# EAGLE design Adafruit-MAX17048-STEMMA (EAGLE 9.6.2)
COMPANY: ADAFRUIT INDUSTRIES; DRAWN: KTOWN; REV: A
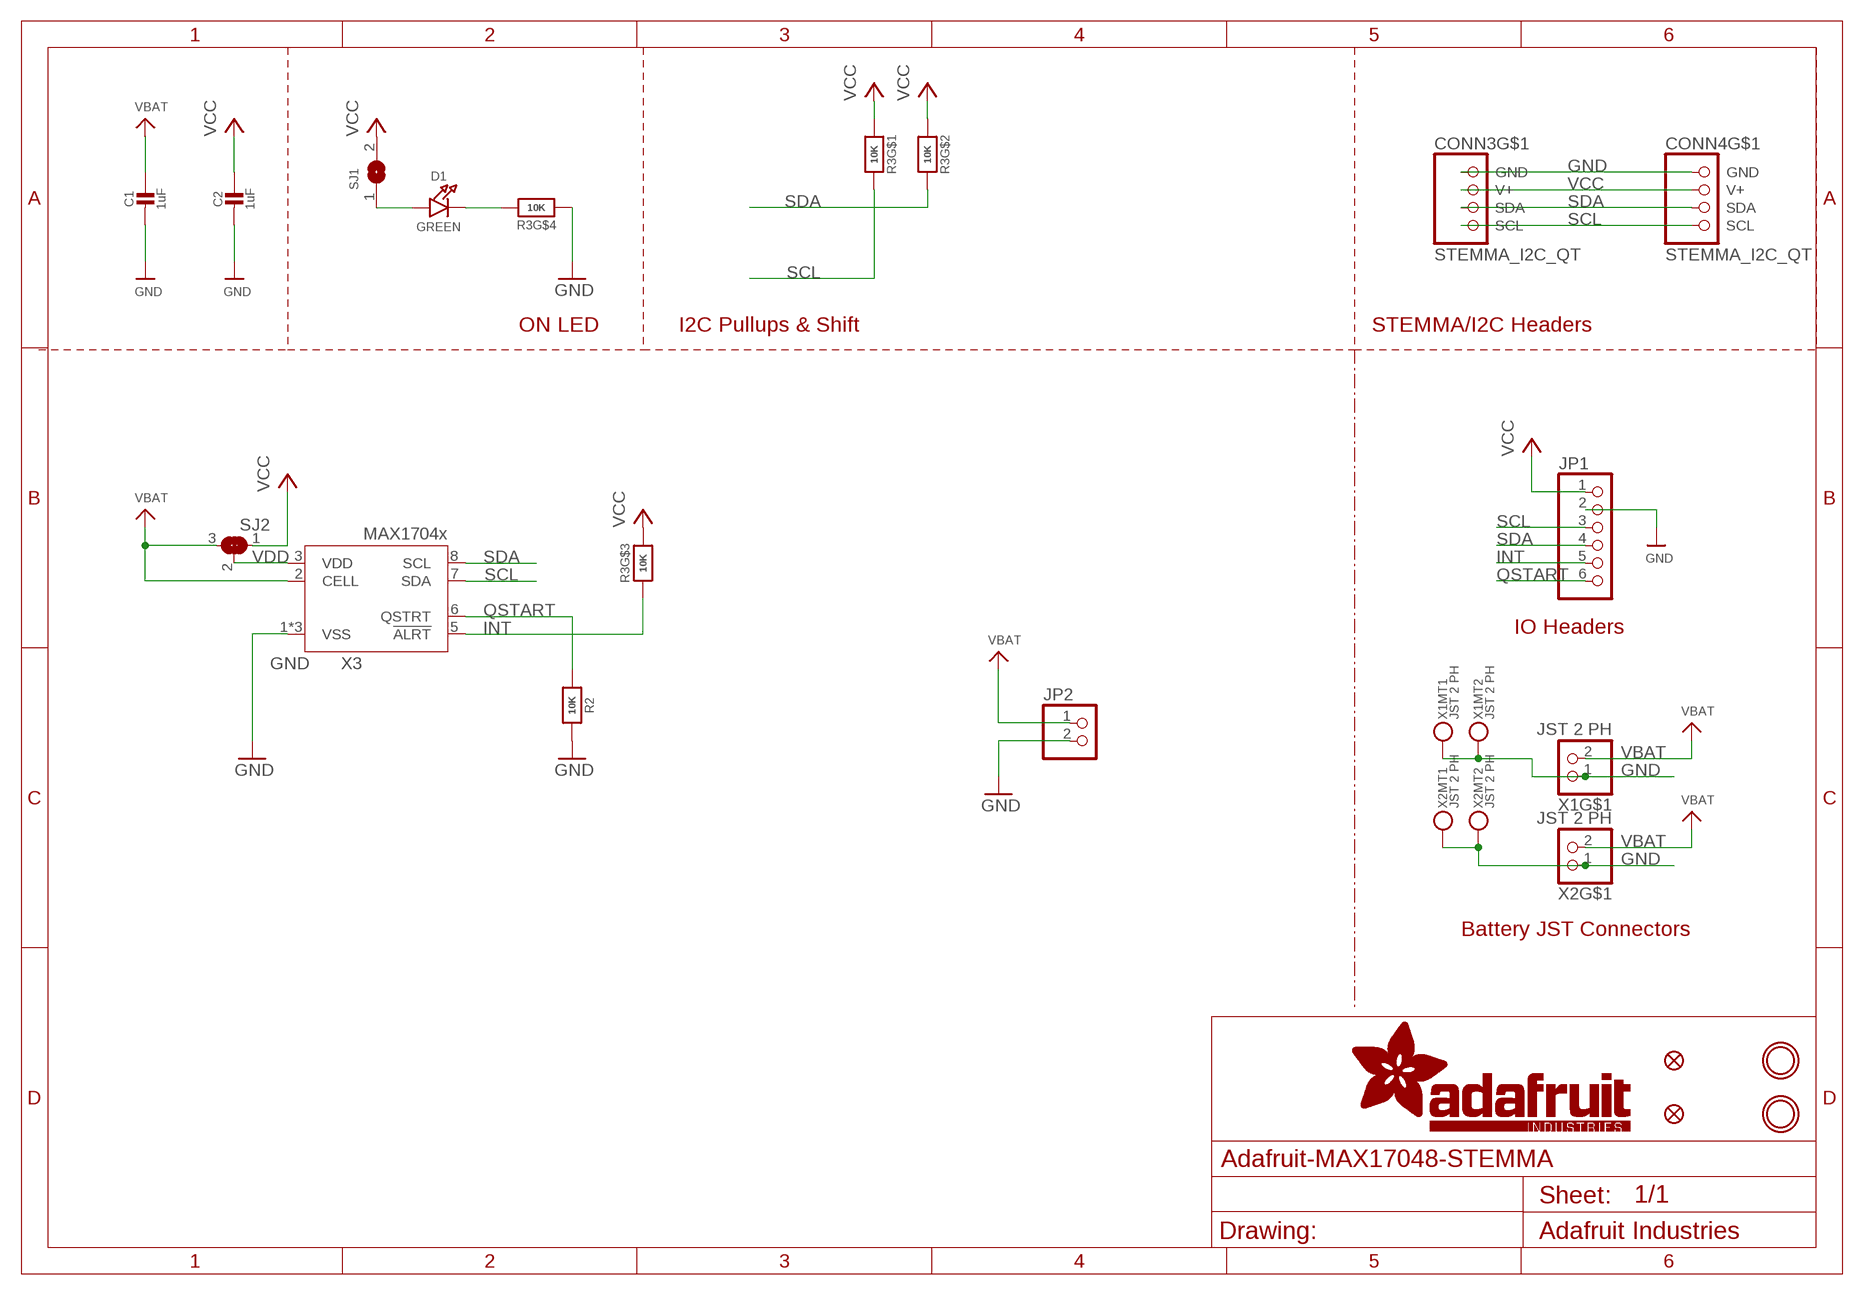
[diagram p0: schematic, sheet 1]

## Parts
C1  1uF  CAP_CERAMIC0603_NO  [0603-NO]
C2  1uF  CAP_CERAMIC0603_NO  [0603-NO]
CONN3  STEMMA_I2C_QT  [JST_SH4]
CONN4  STEMMA_I2C_QT  [JST_SH4]
D1  GREEN  LED0603_NOOUTLINE  [CHIPLED_0603_NOOUTLINE]
FID3  FIDUCIAL_1MM  [FIDUCIAL_1MM]
FID4  FIDUCIAL_1MM  [FIDUCIAL_1MM]
JP1  HEADER-1X670MIL  [1X06_ROUND_70]
JP2  HEADER-1X2ROUND  [1X02_ROUND]
R2  10K  RESISTOR_0603_NOOUT  [0603-NO]
R3  10K  RESISTOR_4PACK  [RESPACK_4X0603]
SJ1  SOLDERJUMPERCLOSED  [SOLDERJUMPER_CLOSEDWIRE]
SJ2  SOLDERJUMPER_2WAY  [SOLDERJUMPER_2WAY_OPEN_NOPASTE]
U$19  MOUNTINGHOLE2.5  [MOUNTINGHOLE_2.5_PLATED]
U$21  MOUNTINGHOLE2.5  [MOUNTINGHOLE_2.5_PLATED]
X1  JST 2 PH  CON_JST_PH_2PIN_MT_BATT  [JSTPH2_BATT]
X2  JST 2 PH  CON_JST_PH_2PIN_MT_BATT  [JSTPH2_BATT]
X3  MAX17048/T  [TDFN8_2X2MM]

## Nets
GND [highpower]: C1.2 C2.2 CONN3.1(GND) CONN4.1(GND) JP1.2 JP2.2 R2.2 R3.4 X1.1 X1.NC1 X1.NC2 X2.1 X2.NC1 X2.NC2 X3.1(VSS) X3.4(VSS) X3.THERMAL(VSS)
INT: JP1.5 R3.3 X3.5(!ALRT)
N$1: D1.C R3.5
N$2: D1.A SJ1.1
QSTART: JP1.6 R2.1 X3.6(QSTRT)
SCL: CONN3.4(SCL) CONN4.4(SCL) JP1.3 R3.8 X3.7(SDA)
SDA: CONN3.3(SDA) CONN4.3(SDA) JP1.4 R3.7 X3.8(SCL)
VBAT [highpower]: C1.1 JP2.1 SJ2.3 X1.2 X2.2 X3.2(CELL)
VCC [lowpower]: C2.1 CONN3.2(V+) CONN4.2(V+) JP1.1 R3.1 R3.2 R3.6 SJ1.2 SJ2.1
VDD: SJ2.2 X3.3(VDD)
Unconnected: CONN3.MT1(MT) CONN3.MT2(MT) CONN4.MT1(MT) CONN4.MT2(MT)

## Notes on the sheet
- ON LED | I2C Pullups & Shift | STEMMA/I2C Headers
- IO Headers
- Battery JST Connectors

## Library data of the parts
C1 C2 = microbuilder:CAP_CERAMIC: Ceramic Capacitors For new designs, use the packages preceded by an '_' character since they are more reliable: The following footprints should be used on most boards: _0402 - Standard footprint for regular board layouts _0603 - Standard footprint for regular board layouts _0805 - Standard footprint for regular board layouts _1206 - Standard footprint for regular board layouts For extremely tight-pitch boards where space is at a premium, the following 'micro-pitch' footprints can be used (smaller pads, no silkscreen outline, etc.): _0402MP - Micro-pitch footprint for very dense/compact boards _0603MP - Micro-pitch footprint for very dense/compact boards _0805MP - Micro-pitch footprint for very dense/compact boards _1206MP - Micro-pitch footprint for very dense/compact boards
CONN3 CONN4 = microbuilder:STEMMA_I2C
D1 = microbuilder:LED: LED 0603 - 0603 Surface Mount Package 2mA: Green LED - Low Power (3.9mcd, 2ma, 1.7Vf) - Digikey: 475-2709-2-ND Orange LED - Low Power (9.8mcd, 2ma, 1.8Vf) - Digikey: 475-1194-2-ND Red LED - Low Power (5mcd, 2ma, 1.8Vf) - Digikey: 475-1195-2-ND Yellow LED - Low Power (7mcd, 2ma, 1.8Vf) - Digikey: 475-1196-2-ND 5mA: Blue LED - Low Power (17mcd, 5ma, 2.9Vf) - Digikey: LNJ937W8CRACT-ND 0805 - 0805 Surface Mount Package 2mA: Red LED (8.8mcd, 2mA, 1.8Vf, Clear) - Low Power [Digikey: 475-2510-1-ND] Green LED (5mcd, 2mA, 1.8Vf, Clear) - Low Power [Digikey: 475-2730-1-ND] Yellow LED (11.3mcd, 2mA, 1.8Vf, Clear) - Low Power [Digikey: 475-2555-1-ND] 20mA: Red LED (104mcd, 20mA, Diffused) - LS R976 [Digikey: 475-1278-6-ND] Red LED (12mcd, 20mA, 2.0Vf, Clear) - APT2012EC [Digikey: 754-1128-1-ND] Green LED (15mcd, 20mA, 2.2Vf, Clear) - APT2012GC [Digikey: 754-1131-1-ND] Orange LED (160mcd, 20mA, 2.1Vf, Clear) - APT2012SECK [Digikey: 754-1130-1-ND] 1206 - 1206 Surface Mount Package Green LED (26mcd, 20mA, Diffused) - LG N971 [Digikey: 475-1407-6-ND] Red LED (15mcd, 20mA, Diffused) - LH N974 [Digikey: 475-1416-6-ND] Cree - Cree High-Power Surface Mount LEDs XPEBWT-L1-0000-00D50 - White 111lm 350mA 2.9Vf 6200K 110° XTEAWT-00-0000-00000LEE3 - White 114lm 350mA 2.85Vf 5000K 115° Everlight - Everlight 45-21 Series Surface Mount LEDs 45-21/QK2C-B2832AC2CB2/2T - Warm White 2000mcd 20mA 3.25Vf 3050K 120° 45-21/LK2C-B38452C4CB2/2T - Nuetral White 2000mcd 20mA 3.25Vf 4150K 120° 45-21/LK2C-B50634C6CB2/2T - Cold White 2200mcd 20mA 3.25Vf 5650K 120° PLCC2 Reverse Mount LS T77K-J1L2-1-0-2-R18-Z - Red 11.25mcd 2mA 1.8Vf 630nm 120° LO T77K-L1M2-24-Z - Orange 19.6mcd 2mA 1.8Vf 606nm 120° LY T77K-K2M1-26-Z - Yellow 15.7mcd 2mA 1.8Vf 587nm 120°
FID3 FID4 = microbuilder:FIDUCIAL: Fiducial Alignment Points Various fiducial points for machine vision alignment.; BOM: EXCLUDE
JP1 = microbuilder:HEADER-1X6: PIN HEADER
JP2 = microbuilder:HEADER-1X2: PIN HEADER
R2 = microbuilder:RESISTOR: Resistors For new designs, use the packages preceded by an '_' character since they are more reliable: The following footprints should be used on most boards: _0402 - Standard footprint for regular board layouts _0603 - Standard footprint for regular board layouts _0805 - Standard footprint for regular board layouts _1206 - Standard footprint for regular board layouts For extremely tight-pitch boards where space is at a premium, the following 'micro-pitch' footprints can be used (smaller pads, no silkscreen outline, etc.): _0402MP - Micro-pitch footprint for very dense/compact boards _0603MP - Micro-pitch footprint for very dense/compact boards _0805MP - Micro-pitch footprint for very dense/compact boards _1206MP - Micro-pitch footprint for very dense/compact boards
R3 = microbuilder:RESISTOR_4PACK: Resistor Packs (4 resistors) 4 x 0603 10K 1/16W - Digikey: YC164J-10KCT-ND
SJ1 = microbuilder:SOLDERJUMPER: SMD Solder JUMPER Solder the two pads together to create a connection, or remove the solder to break it. REFLOW - Use this footprint for solder paste and reflow ovens. WAVE - Use this footprint for hand-soldering (larger pads). CLOSED - Has a trace between the two pads to ensure it is closed by default. The trace needs to be cut to disable the jumper, and can be closed again by creating a solder bridge between the two pads.
SJ2 = microbuilder:SOLDERJUMPER_2WAY: 2-Way Solder Jumper
U$19 U$21 = microbuilder:MOUNTINGHOLE: Mounting Hole For #2 screws (0.086"/2.18mm width, 0.094"/2.4mm hole) use 2.5mm; BOM: EXCLUDE
X1 X2 = adafruit_electromech:CON_JST_PH_2PIN_MT
X3 = adafruit_sensor:MAX17048

## Net classes
1 highpower: width 0.406 mm, drill 0.483 mm
2 lowpower: width 0.305 mm, drill 0.483 mm

## Board
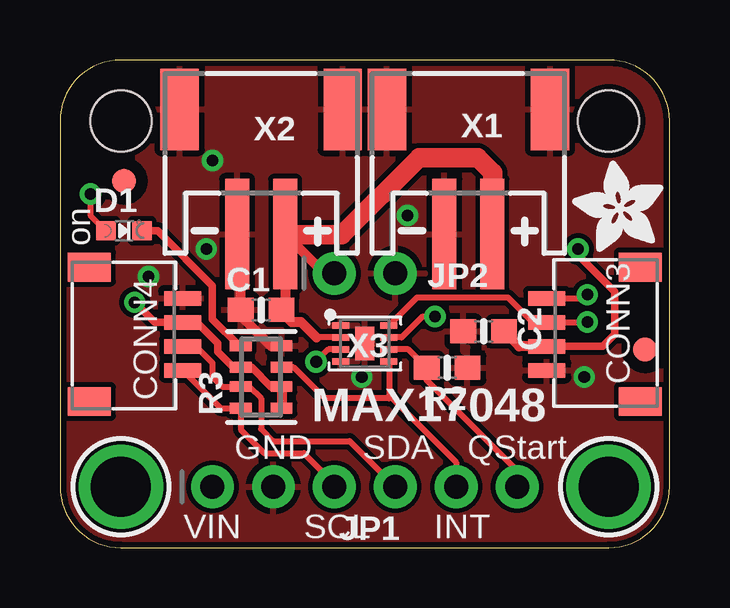
[diagram p1: board, top side]
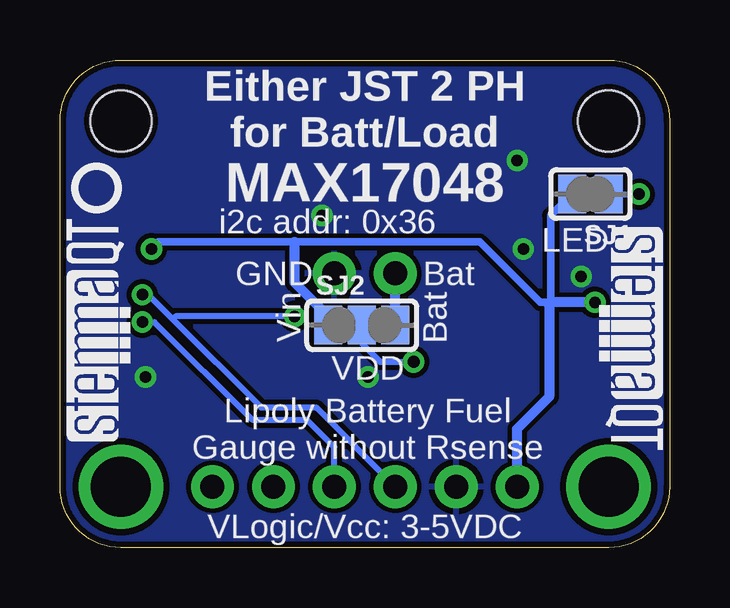
[diagram p2: board, bottom side, seen from below]

Size 25.4 x 20.32 mm. Coordinates in mm from the lower left corner, seen from the top.
Outline: 0,17.78 0,2.54 arc90 2.54,0 22.86,0 arc90 25.4,2.54 25.4,17.78 arc90 22.86,20.32 2.54,20.32 arc90 0,17.78
Copper layers (1*16): Top 0.035mm / dielectric 1.5mm / Bottom 0.035mm
Design rules "adafruit *": minimum track width 8mil, minimum drill 15.5mil, track to track 8mil, track to pad 8mil, pad to pad 8mil, via to via 8mil, smd to smd 8mil, copper to edge 10mil, drill to drill 8mil, minimum pad ring 10mil, minimum via ring 8mil, stop-mask expansion 2mil, vias tented up to drill 20mil, thermal gap 10mil
Holes 2.54 mm at 2.54,17.78 22.86,17.78

### Footprints (pad centres in the part's own frame; a part is rotated, then mirrored left to right if it is on the bottom)
0603-NO = smd 1.075 x 1: 1 -0.85,0; 2 0.85,0
JST_SH4 = smd 0.6 x 1.55: 1 -1.5,2.514; 2 -0.5,2.514; 3 0.5,2.514; 4 1.5,2.514 | smd 1.2 x 1.8: MT1 -2.8,-1.386; MT2 2.8,-1.386
CHIPLED_0603_NOOUTLINE = smd 0.8 x 0.8: A 0,-0.75; C 0,0.75
FIDUCIAL_1MM = smd 1 x 1: 1 0,0
1X06_ROUND_70 = drill 1 pad 1.778: 1 -6.35,0; 2 -3.81,0; 3 -1.27,0; 4 1.27,0; 5 3.81,0; 6 6.35,0
1X02_ROUND = drill 1 pad 1.778: 1 -1.27,0; 2 1.27,0
RESPACK_4X0603 = smd 0.45 x 0.9: 1 -1.3,-0.85; 2 -0.4,-0.85; 3 0.4,-0.85; 4 1.3,-0.85; 5 1.3,0.85; 6 0.4,0.85; 7 -0.4,0.85; 8 -1.3,0.85
SOLDERJUMPER_CLOSEDWIRE = smd 1.168 x 1.6: 1 -0.762,0; 2 0.762,0 | smd 0.635 x 0.203: WIRE 0,0
SOLDERJUMPER_2WAY_OPEN_NOPASTE = smd 1.168 x 1.6: 1 -1.397,0; 2 0,0; 3 1.397,0
MOUNTINGHOLE_2.5_PLATED = drill 2.5 pad 3.2: P$1 0,0
JSTPH2_BATT = smd 1 x 4.6: 1 -1,-3.7; 2 1,-3.7 | smd 1.6 x 3.4: NC1 -3.4,1.5; NC2 3.4,1.5
TDFN8_2X2MM = smd 0.7 x 0.275: 1 -1,0.75; 2 -1,0.25; 3 -1,-0.25; 4 -1,-0.75; 5 1,-0.75; 6 1,-0.25; 7 1,0.25; 8 1,0.75 | smd 0.8 x 1.38: THERMAL 0,0

### Placement (x,y rotation side)
C1  8.38,9.91 180 top
C2  17.65,9.02 180 top
CONN3  22.8,8.89 90 top
CONN4  2.6,8.89 270 top
D1  2.67,13.21 270 top
FID3  24.38,8.26 0 top
FID4  2.67,15.28 0 top
JP1  12.7,2.54 0 top
JP2  12.7,11.43 0 top
R2  16.13,7.49 0 top
R3  8.38,7.11 90 top
SJ1  3.3,14.73 180 bottom
SJ2  12.83,9.27 0 bottom
U$19  2.54,2.54 0 top
U$21  22.86,2.54 0 top
U$22  [ADAFRUIT_3.5MM]  25.15,12.32 90 top
U$25  [PCBFEAT-REV-040]  23.88,14.99 0 bottom
U$30  [STEMMAQT]  22.48,4.45 90 bottom
U$31  [STEMMAQT]  2.92,13.34 270 bottom
X1  17.02,16.76 0 top
X2  8.38,16.76 0 top
X3  12.7,8.51 0 top

### Tracks (layer width: path | path; a pad name or v marks a point on that pad's centre or on a via)
GND  (via drill 0.48)
  Top 0.406: X2.1 7.53,12.91 C1.2 7.53,9.66 8.78,8.41 R3.4
  other vias: 6.1,12.45 3.68,11.3 14.48,13.84 6.35,16.13 21.84,7.11 12.57,7.11
  pour Top: 0,20.32 25.4,20.32 25.4,0 0,0
  pour Bottom: 0,20.32 25.4,20.32 25.4,0 0,0
INT
  Top 0.254: JP1.5 16.51,3.56 13.72,6.35 | R3.3 9.73,7.51 11.02,6.22 13.72,6.22 13.72,6.35 | X3.5 13.72,7.74 13.72,6.35
N$1
  Top 0.305: D1.C 4.06,13.21 6.35,10.92 6.35,9.53 7.46,8.41 R3.5
N$2  (via drill 0.48)
  Top 0.254: D1.A 1.27,13.86 v1.27,14.73
  Bottom 0.254: SJ1.1 v1.27,14.73
N$4
  Bottom 0.203: 12.45,9.27 11.81,9.27
QSTART
  Top 0.254: JP1.6 19.05,3.21 15.28,6.99 R2.1 14.51,8.26 X3.6
SCL  (via drill 0.48)
  Top 0.254: CONN4.4 6.7,5.81 R3.8 7.53,4.91 8.51,3.94 10.16,3.94 11.43,2.67 JP1.3 | CONN3.4 21.82,10.39 v21.97,10.54 | v15.62,9.64 15.12,9.64 14.24,8.76 X3.7
  Bottom 0.254: JP1.3 14.73,5.84 17.02,5.84 20.7,9.53 | v21.97,10.54 21.72,10.54 20.7,9.53 | v15.62,9.64 20.59,9.64 20.7,9.53
SDA  (via drill 0.48)
  Top 0.254: CONN4.3 5.66,8.39 6.35,7.7 6.35,7.11 6.75,6.71 R3.7 7.89,6.71 8.38,6.22 8.38,4.95 8.89,4.45 12.06,4.45 JP1.4 | v21.97,9.4 v21.96,9.39 CONN3.3 19.69,9.39 18.67,10.41 14.87,10.41 13.72,9.26 X3.8
  Bottom 0.254: v21.97,9.4 21.46,9.4 17.4,5.33 15.11,5.33 13.97,4.19 JP1.4
VBAT
  Top 0.254: X3.2 10.68,8.76
  Top 0.406: 9.38,10.06 X2.2 11.02,11.43 JP2.1 | 9.38,10.06 9.38,9.67 9.66,9.39 10.05,9.39 10.68,8.76 | C1.1 9.38,10.06
  Top 0.813: X2.2 9.41,13.03 11.75,13.03 14.97,16.26 17.4,16.26 18.03,15.62 18.03,13.08 X1.2
  Bottom 0.406: SJ2.3 JP2.1
VCC  (via drill 0.48)
  Top 0.305: v3.11,10.22 3.94,9.39 CONN4.2 5.7,9.39 6.57,8.52 6.57,8.17 7.22,7.51 R3.6 7.98,7.51 8.78,6.71 R3.2 | CONN3.2 22.61,8.39 23.11,8.89 23.11,10.67 21.59,12.19 v21.59,12.45
  Top 0.406: R3.2 R3.1 | CONN3.2 19.13,8.39 C2.1
  Bottom 0.305: v21.59,12.45 21.3,12.74 15.62,12.74 7.91,12.74 5.4,10.22 4.83,10.22 | 4.83,10.22 v3.11,10.22 | SJ1.2 4.95,13.84 4.95,10.35 4.83,10.22
  Bottom 0.406: JP1.1 6.35,4.95 5.02,6.29 5.02,10.1 4.89,10.22 v3.11,10.22 | SJ2.1 14.22,9.65 15.62,11.05 15.62,12.74
VDD  (via drill 0.5)
  Top 0.254: X3.3 11.18,8.26 v10.67,7.75
  Bottom 0.254: v10.67,7.75 12.06,7.75 12.83,8.51 SJ2.2

### Text on the board
tPlace: on | MAX17048 | GND | SDA | QStart | VIN | SCL | INT
bPlace: Either JST 2 PH / for Batt/Load | MAX17048 | LED | i2c addr: 0x36 | GND | Bat | Bat | Vin | VDD | Lipoly Battery Fuel / Gauge without Rsense | VLogic/Vcc: 3-5VDC